# Altium schematic sheet 06.GPIO.SchDoc
size A4; DocumentNumber: 07; SheetNumber: 7; SheetTotal: 8; Page: GPIO
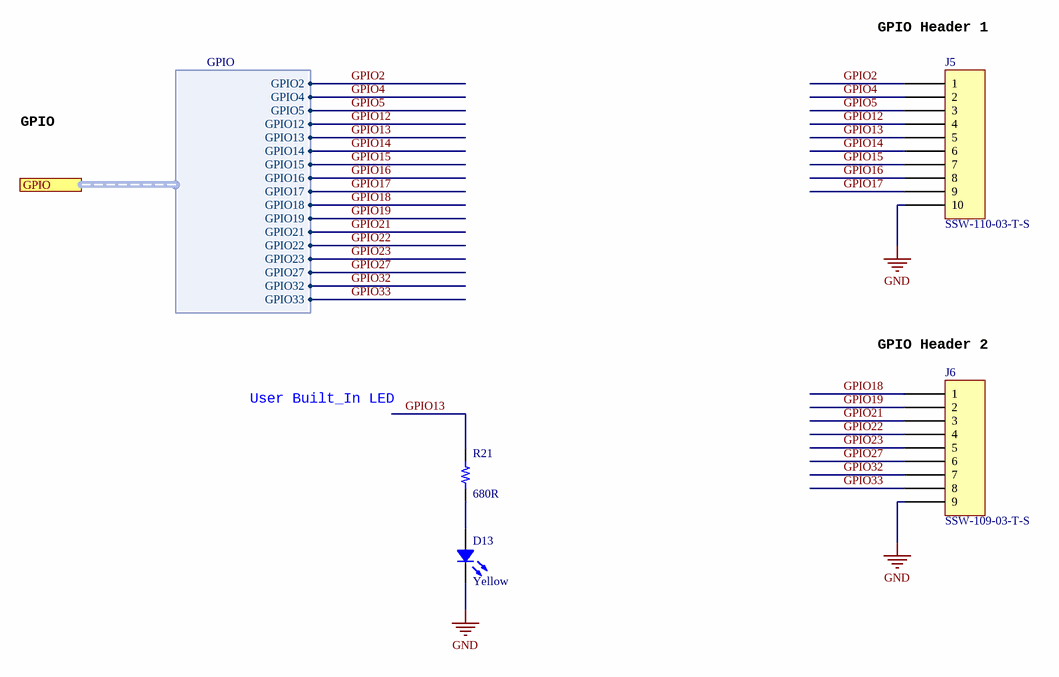
[diagram p0: 06.GPIO.SchDoc]

## Parts
D13  Yellow  [LED 0603_1608 YELLOW]
J5  SSW-110-03-T-S  [SAMTEC SSW-110-03-T-S]
J6  SSW-109-03-T-S  [SAMTEC SSW-109-03-T-S]
R21  680R  [RES 0603_1608]

## Ports
GPIO (harness GPIO)

## Harnesses
GPIO: GPIO2, GPIO4, GPIO5, GPIO12, GPIO13, GPIO14, GPIO15, GPIO16, GPIO17, GPIO18, GPIO19, GPIO21, GPIO22, GPIO23, GPIO27, GPIO32, GPIO33

## Nets
GND: D13.2 J5.10 J6.9
GPIO2: J5.1 ; port GPIO.GPIO2
GPIO4: J5.2 ; port GPIO.GPIO4
GPIO5: J5.3 ; port GPIO.GPIO5
GPIO12: J5.4 ; port GPIO.GPIO12
GPIO13: J5.5 R21.2 ; port GPIO.GPIO13
GPIO14: J5.6 ; port GPIO.GPIO14
GPIO15: J5.7 ; port GPIO.GPIO15
GPIO16: J5.8 ; port GPIO.GPIO16
GPIO17: J5.9 ; port GPIO.GPIO17
GPIO18: J6.1 ; port GPIO.GPIO18
GPIO19: J6.2 ; port GPIO.GPIO19
GPIO21: J6.3 ; port GPIO.GPIO21
GPIO22: J6.4 ; port GPIO.GPIO22
GPIO23: J6.5 ; port GPIO.GPIO23
GPIO27: J6.6 ; port GPIO.GPIO27
GPIO32: J6.7 ; port GPIO.GPIO32
GPIO33: J6.8 ; port GPIO.GPIO33
NetD13_1: D13.1 R21.1

## Notes on the sheet
- (near J5) GPIO Header 1
- GPIO
- (near J6) GPIO Header 2
- User Built_In LED
- Title :
- Size:
- Date:
- Page :
- A4
- Number:
- Time:
- Revision:
- Sheet
- of
- Sheet Name :
- Drawn By :

## Library data of the parts
D13 = 5990040007F: 无色透明透镜 -40℃~+85℃ 572nm Green-yellow 120° 60mW 0603 Light Emitting Diodes (LED) ROHS; Manufacturer Part Number: MHT192JGCT; Manufacturer: MEIHUA; JLC Part Number: C473820
J5 = SSW-110-03-T-S: CONN RCPT 10POS 0.1 TIN PCB; Manufacturer: Samtec Inc.; Manufacturer Part Number: SSW-110-03-T-S; JLC Part Number: C3322776
J6 = SSW-109-03-T-S: CONN RCPT 9POS 0.1 TIN PCB; Manufacturer: Samtec Inc.; Manufacturer Part Number: SSW-109-03-T-S; JLC Part Number: *
R21 = CRCW0603150RFKEA: 100mW Thick Film Resistors ±100ppm/℃ ±1% 680Ω 0603 Chip Resistor - Surface Mount ROHS; Manufacturer Part Number: RC0603FR-07680RL; Manufacturer: YAGEO; Value: 680R; JLC Part Number: C112310